# EAGLE design Burpg_altimeter_v1 (EAGLE 6.5.0)
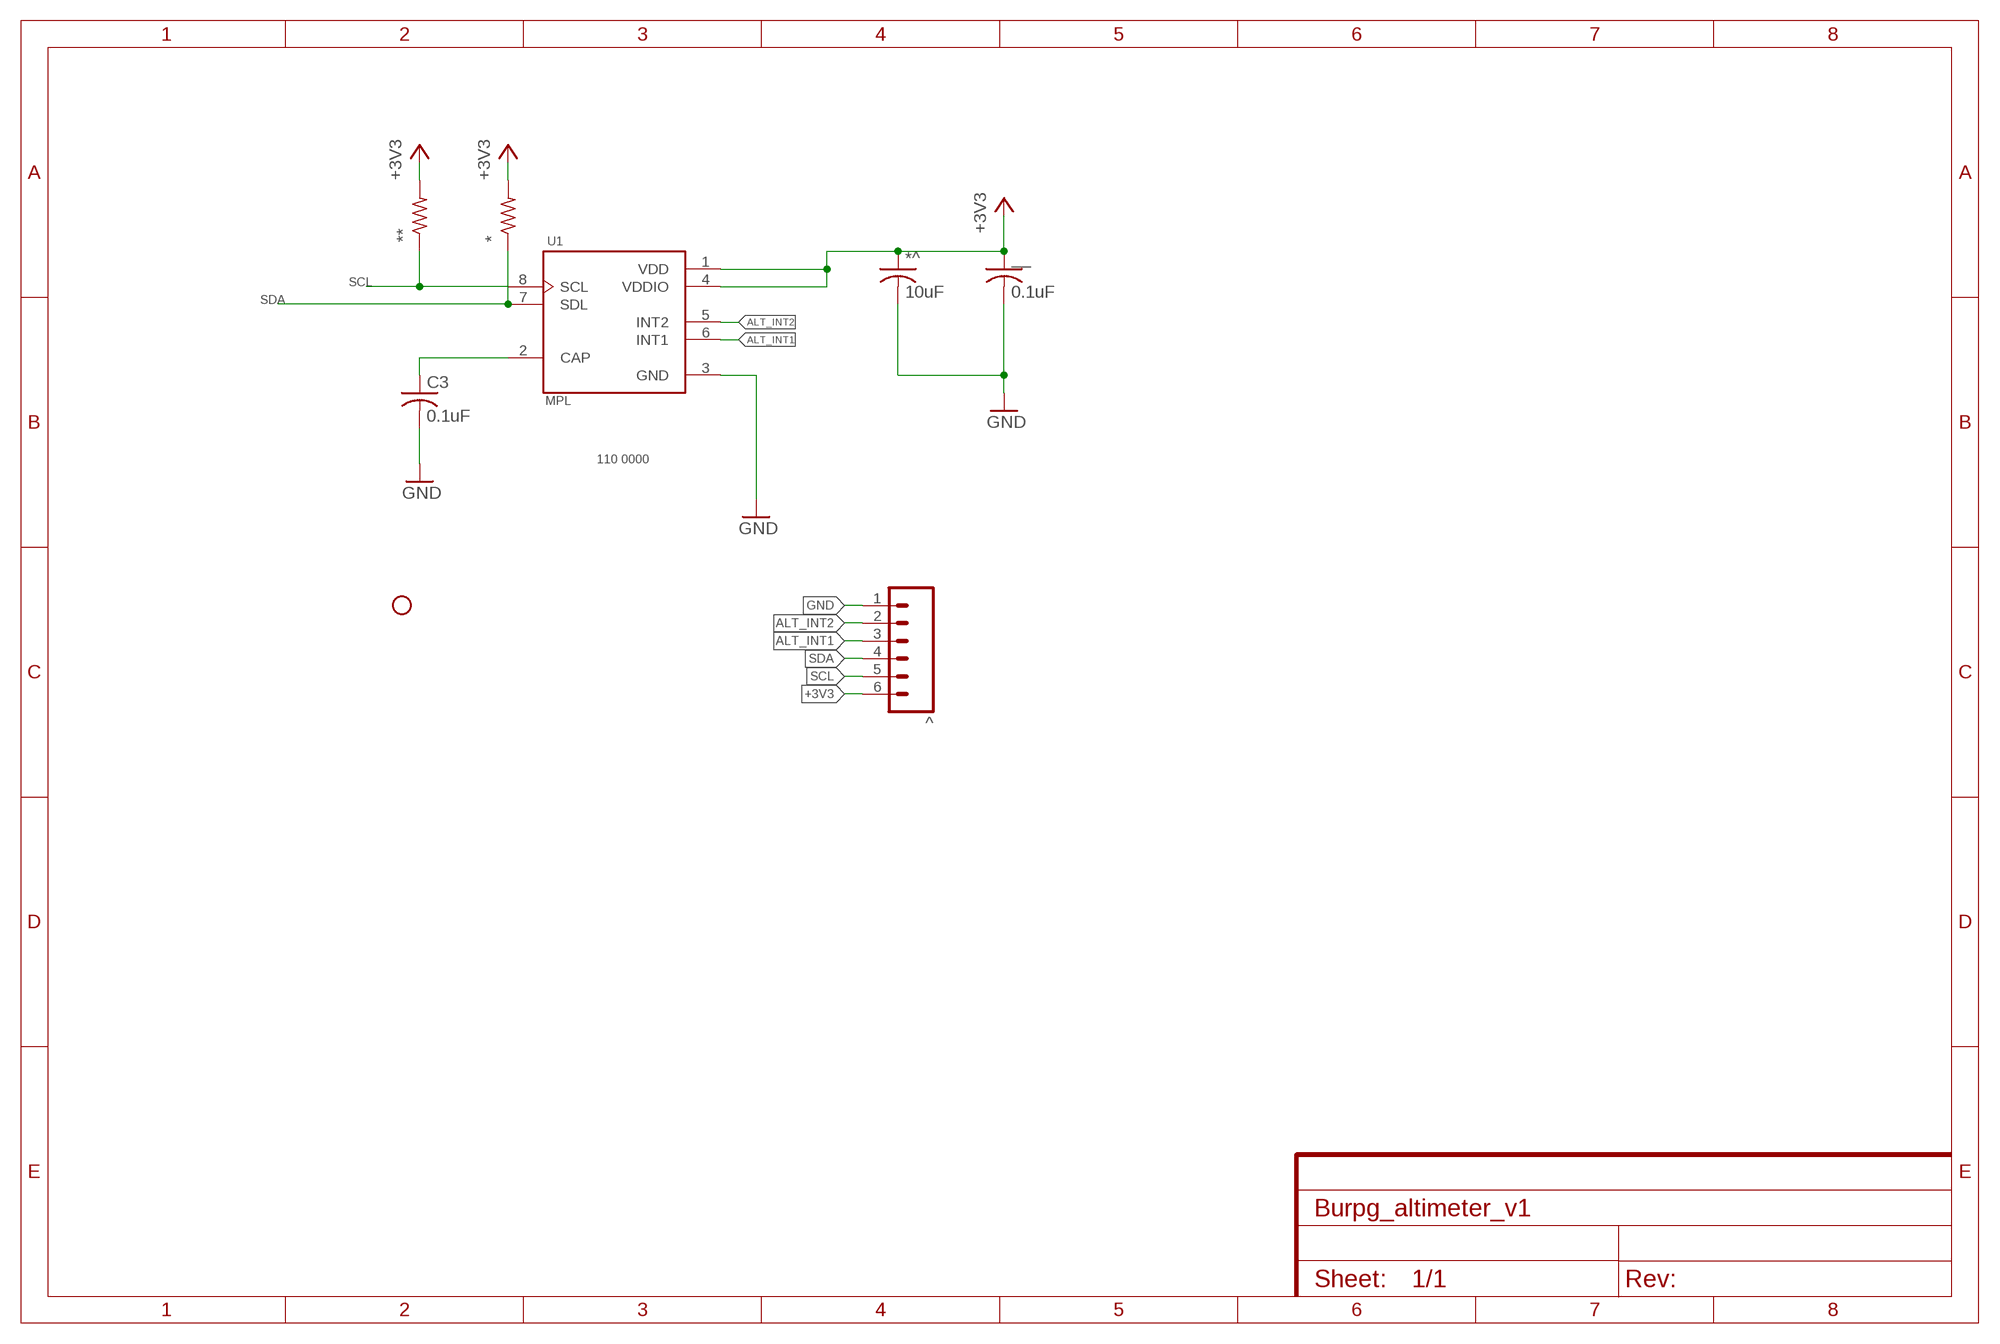
[diagram p0: schematic, sheet 1]

## Parts
*  R-US_R0603  [R0603]
**  R-US_R0603  [R0603]
*^  10uF  C-USC0603K  [C0603K]
^  M06SILK_FEMALE_PTH  [1X06]
_  #4_philip  STAND-OFF  [STAND-OFF]
__  0.1uF  C-USC0603K  [C0603K]
C3  0.1uF  C-USC0603K  [C0603K]
U1  MPL  MPL3115A2  [PSON125P300X500X120-8N]

## Nets
+3V3: **.2 *.2 *^.1 ^.6 __.1 U1.1(VDD) U1.4(VDDIO)
ALT_INT1: ^.3 U1.6(INT1)
ALT_INT2: ^.2 U1.5(INT2)
GND: *^.2 ^.1 __.2 C3.2 U1.3(GND)
N$1: C3.1 U1.2(CAP)
SCL: **.1 ^.5 U1.8(SCL)
SDA: *.1 ^.4 U1.7(SDL)

## Notes on the sheet
- 110 0000

## Library data of the parts
* ** = rcl:R-US_: RESISTOR, American symbol
*^ __ C3 = rcl:C-US: CAPACITOR, American symbol
^ = SparkFun-Connectors:M06: Header 6 Standard 6-pin 0.1" header. Use with straight break away headers (SKU : PRT-00116), right angle break away headers (PRT-00553), swiss pins (PRT-00743), machine pins (PRT-00117), and female headers (PRT-00115). Molex polarized connector foot print use with SKU : PRT-08094 with associated crimp pins and housings. NOTES ON THE VARIANTS LOCK and LOCK_LONGPADS... This footprint was designed to help hold the alignment of a through-hole component (i.e. 6-pin header) while soldering it into place. You may notice that each hole has been shifted either up or down by 0.005 of an inch from it's more standard position (which is a perfectly straight line). This slight alteration caused the pins (the squares in the middle) to touch the edges of the holes. Because they are alternating, it causes a "brace" to hold the component in place. 0.005 has proven to be the perfect amount of "off-center" position when using our standard breakaway headers. Although looks a little odd when you look at the bare footprint, once you have a header in there, the alteration is very hard to notice. Also,if you push a header all the way into place, it is covered up entirely on the bottom side. This idea of altering the position of holes to aid alignment will be further integrated into the Sparkfun Library for other footprints. It can help hold any component with 3 or more connection pins.; PROD_ID: CONN-08437
_ = SparkFun-Hardware:STAND-OFF: Stand Off Drill holes for mechanically mounting via screws, standoffs, etc. Note: Use the keepout ring to avoid running the screw head into surrounding components. Variant Overviews STAND-OFF - Mechanical footprint for a #4 phillips button head screw. STAND-OFF-TIGHT - Mechanical footprint for a #4 phillips button head screw, Example SparkFun Products Screw - Phillips Head (1/4", 4-40, 10 pack) <https://www.sparkfun.com/products/10453> (PRT-10453) Screw - Phillips Head (1/2", 4-40, 10 pack) <https://www.sparkfun.com/products/10452> (PRT-10452) Screw - Phillips Head (3/4", 4-40, 10 pack) <https://www.sparkfun.com/products/10451> (PRT-10451) Screw - Phillips Head (1", 4-40, 10 pack) <https://www.sparkfun.com/products/10450> (PRT-10450)
U1 = MPL3115A2dd_zedit:MPL3115A2: Pressure Sensor, 50-110kpa, Lga-8; AVAILABILITY: Good; DESCRIPTION: Pressure Sensor, 50-110kpa, Lga-8; MF: NXP Semiconductors; MP: MPL3115A2; PACKAGE: LGA-8 NXP Semiconductors; PRICE: 2.74 USD

## Board
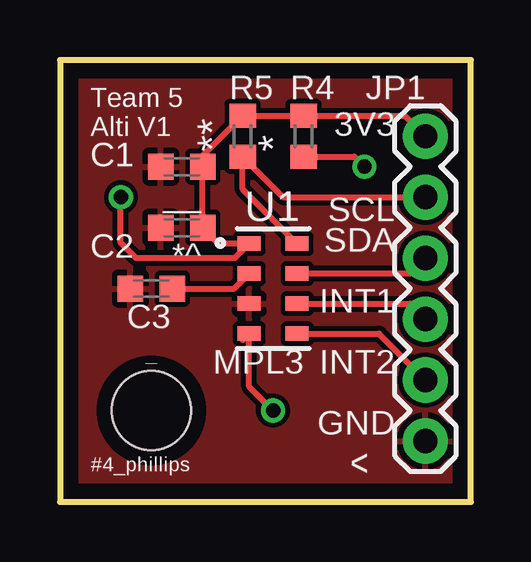
[diagram p1: board, top side]
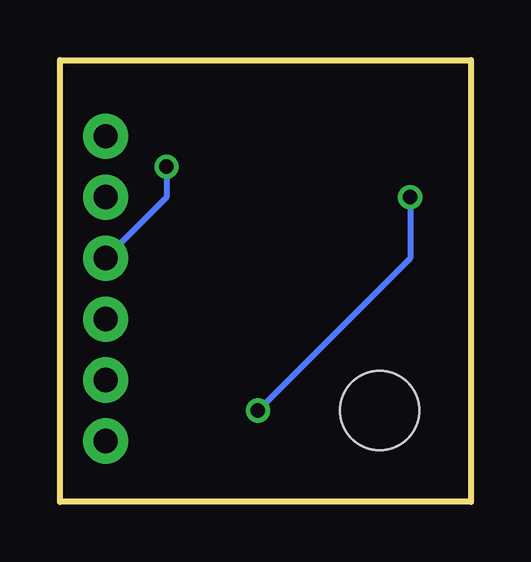
[diagram p2: board, bottom side, seen from below]

Size 17.14 x 18.41 mm. Coordinates in mm from the lower left corner, seen from the top.
Outline: 0,0 17.14,0 17.14,18.41 0,18.41 0,0
Copper layers (1*16): Top 0.035mm / dielectric 1.5mm / Bottom 0.035mm
Design rules "default *": minimum track width 10mil, minimum drill 10mil, track to track 8mil, track to pad 8mil, pad to pad 8mil, via to via 8mil, smd to smd 8mil, copper to edge 25mil, drill to drill 8mil, minimum pad ring 10mil, minimum via ring 8mil, stop-mask expansion 4mil, vias tented up to drill 25mil, thermal gap 10mil

### Footprints (pad centres in the part's own frame; a part is rotated, then mirrored left to right if it is on the bottom)
R0603 = smd 1 x 1.1: 1 -0.85,0; 2 0.85,0
C0603K = smd 1.05 x 1.08: 1 -0.875,0; 2 0.875,0
1X06 = drill 1.016 pad 1.88: 1 0,0; 2 2.54,0; 3 5.08,0; 4 7.62,0; 5 10.16,0; 6 12.7,0
STAND-OFF = hole 3.302: 0,0
PSON125P300X500X120-8N = smd 0.95 x 0.6: 1 -1,1.875; 2 -1,0.625; 3 -1,-0.625; 4 -1,-1.875; 5 1,-1.875; 6 1,-0.625; 7 1,0.625; 8 1,1.875

### Placement (x,y rotation side)
*  10.16,15.24 90 top
**  7.62,15.24 90 top
*^  5.08,11.43 180 top
^  15.24,2.54 90 top
_  3.81,3.81 0 top
__  5.08,13.97 180 top
C3  3.81,8.89 180 top
U1  8.89,8.89 0 top

### Tracks (layer width: path | path; a pad name or v marks a point on that pad's centre or on a via)
+3V3  (via drill 0.6)
  Top 0.254: ^.6 14.39,16.09 *.2 **.2 5.96,14.43 __.1 *^.1 6.62,10.77 U1.1 7.29,10.16 3.17,10.16 2.54,10.79 v2.54,12.7 | 7.62,6.75 U1.4 7.89,4.81 v8.89,3.81
  Bottom 0.254: v2.54,12.7 2.54,10.16 v8.89,3.81
ALT_INT1
  Top 0.254: U1.6 14.6,8.27 ^.3
ALT_INT2
  Top 0.254: U1.5 13.3,7.01 ^.2
GND
  pour Top: 0,0 0,18.41 17.14,18.41 17.14,0
N$1
  Top 0.254: C3.1 7.26,8.89 U1.2
SCL
  Top 0.254: U1.8 7.62,13.04 **.1 9.31,12.7 ^.5
SDA  (via drill 0.6)
  Top 0.254: *.1 12.28,14.39 v12.7,13.97 | ^.4 14.6,9.52 U1.7
  Bottom 0.254: v12.7,13.97 12.7,12.7 ^.4

### Text on the board
tPlace: R5 | R4 | JP1 | Team 5 / Alti V1 | 3V3 | C1 | SCL | SDA | C2 | INT1 | MPL3 | INT2 | GND | #4_phillips